# EAGLE schematic Microcontroller_Schematic_v41 (EAGLE 9.7.0)
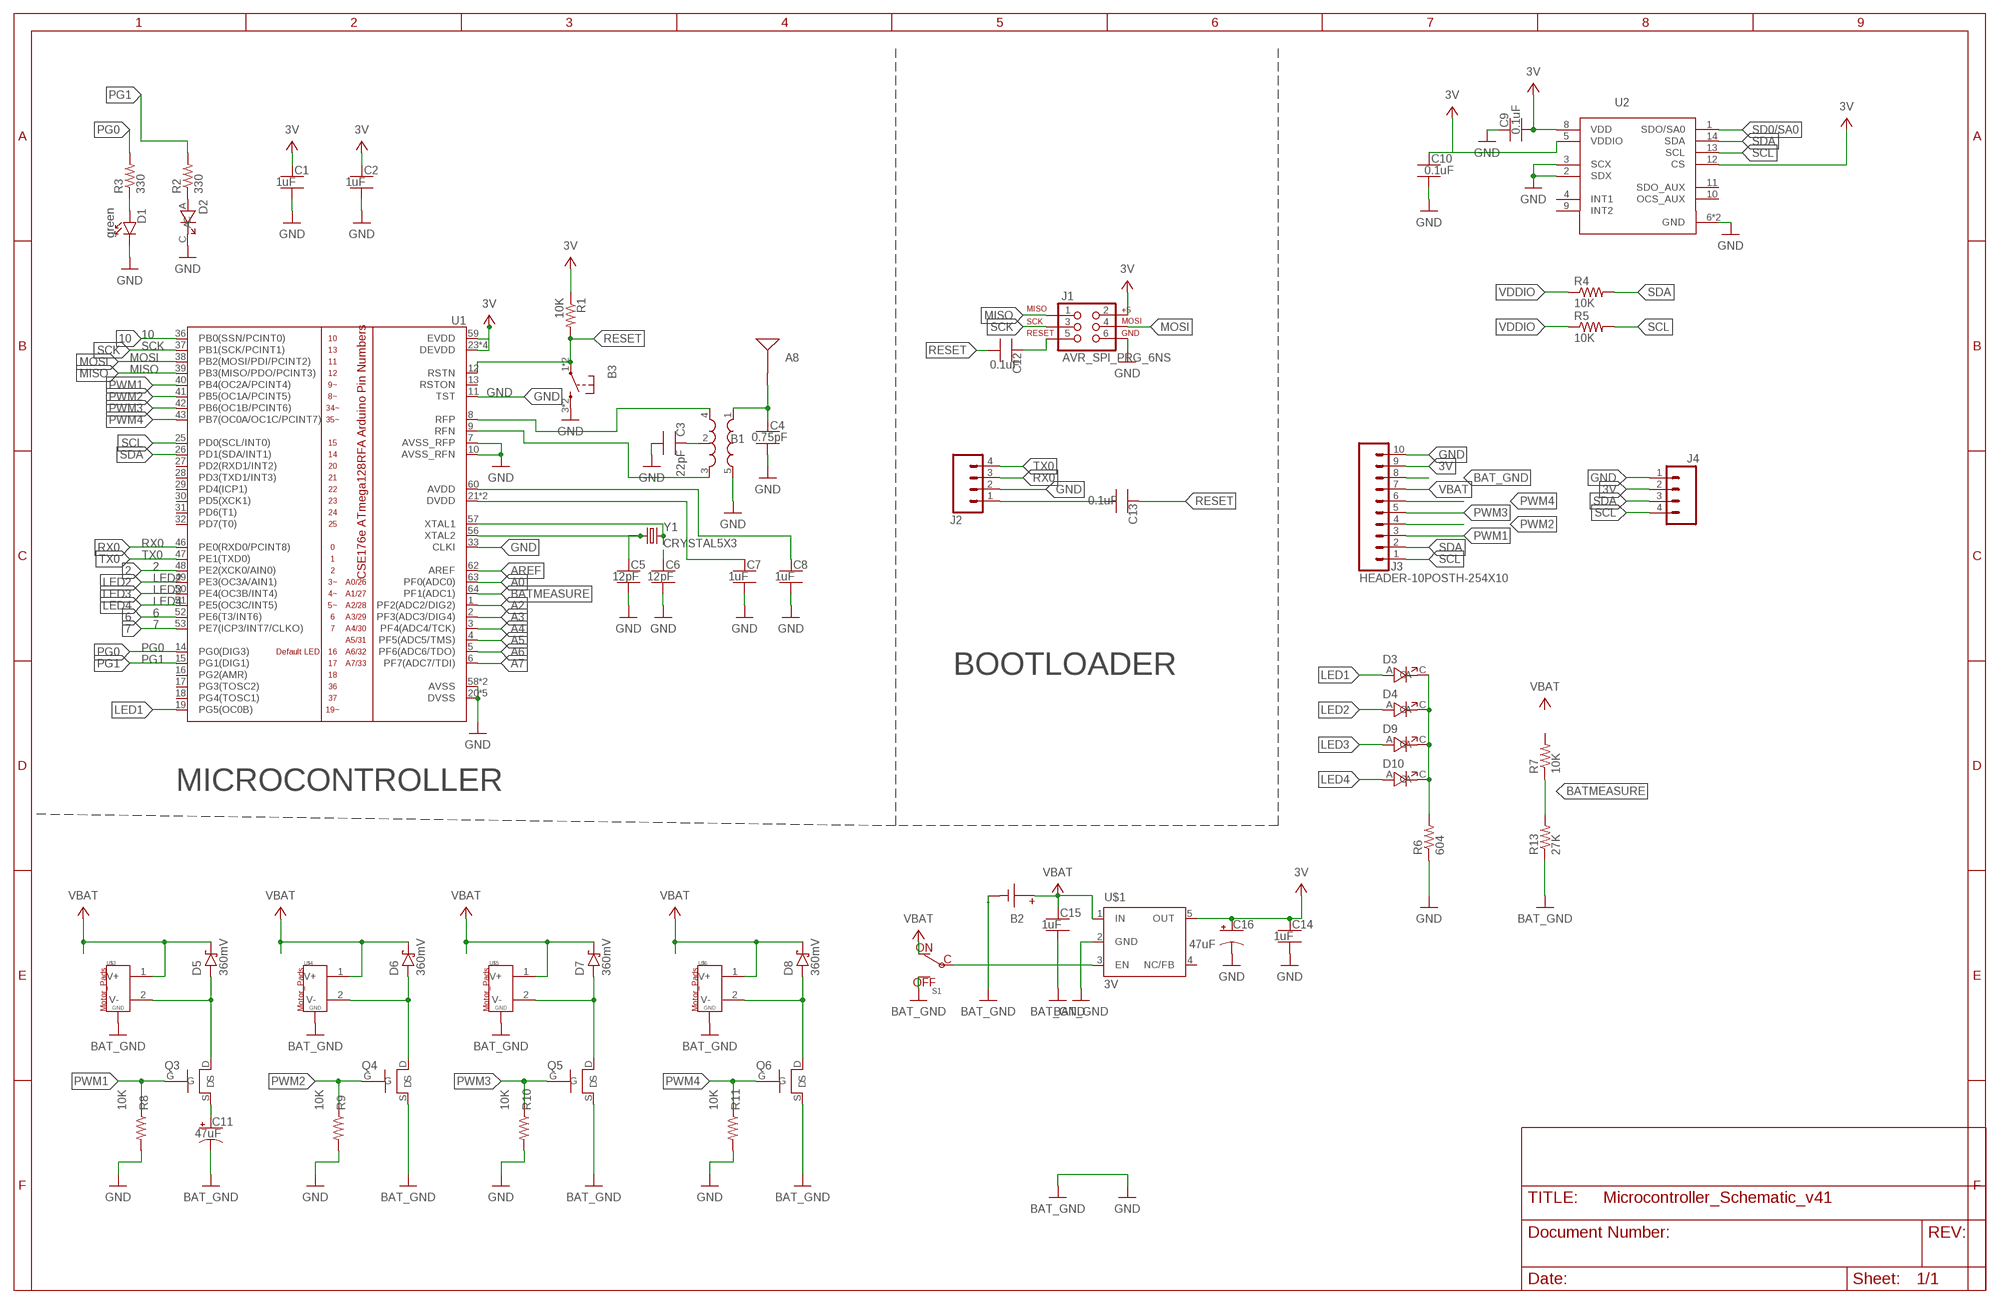
[diagram p0: schematic, sheet 1]
FRAME1 (FRAME_B_L): CREATOR: Unknown; DIST: Unknown; DISTPN: Unknown

## Parts
A8  ANTENNA-BOARD  [ANT_PCB_2.4GHZ_NRF8001_1.6MM_1OZ]
B1  BALUN0805  [BALUN]
B2  BATTERY-SCREW-TERMINAL-MINI-SMD  [2X1-SCREW-TERMINAL-TE-SMD-3.81MM]
B3  PUSHBUTTON_SMD-VERTICAL-1  [TE_FSM8JSMA_HS]
C1  1uF  CAPACITOR-NP_SMD-2012-0805_CERAMIC-1UF  [CAPC2012X140_HS]
C2  1uF  CAPACITOR-NP_SMD-2012-0805_CERAMIC-1UF  [CAPC2012X140_HS]
C3  22pF  CAPACITOR-NP_SMD-2012-0805_CERAMIC-22PF  [CAPC2012X140_HS]
C4  0.75pF  CAPACITOR-NP_SMD-2012-0805_CERAMIC-0.75PF  [CAPC2012X140_HS]
C5  12pF  CAPACITOR-NP_SMD-2012-0805_CERAMIC-12PF  [CAPC2012X140_HS]
C6  12pF  CAPACITOR-NP_SMD-2012-0805_CERAMIC-12PF  [CAPC2012X140_HS]
C7  1uF  CAPACITOR-NP_SMD-2012-0805_CERAMIC-1UF  [CAPC2012X140_HS]
C8  1uF  CAPACITOR-NP_SMD-2012-0805_CERAMIC-1UF  [CAPC2012X140_HS]
C9  0.1uF  CAPACITOR-NP_SMD-2012-0805_CERAMIC-0.1UF  [CAPC2012X140_HS]
C10  0.1uF  CAPACITOR-NP_SMD-2012-0805_CERAMIC-0.1UF  [CAPC2012X140_HS]
C11  47uF  CAPACITOR-POL_47UF-SMD-1206-TAJA  [CAPMP3216X180]
C12  0.1uF  CAPACITOR-NP_SMD-2012-0805_CERAMIC-0.1UF  [CAPC2012X140_HS]
C13  0.1uF  CAPACITOR-NP_SMD-2012-0805_CERAMIC-0.1UF  [CAPC2012X140_HS]
C14  1uF  CAPACITOR-NP_SMD-2012-0805_CERAMIC-1UF  [CAPC2012X140_HS]
C15  1uF  CAPACITOR-NP_SMD-2012-0805_CERAMIC-1UF  [CAPC2012X140_HS]
C16  47uF  CAPACITOR-POL_47UF-SMD-1206-TAJA  [CAPMP3216X180]
D1  green  DIODE-LED_SMD-2012-0805-GREEN  [LEDSC125X200X120-2_HS]
D2  LED-RED-160-1178-1-ND  [LED_160-1178-1-ND]
D3  LED-RED-160-1178-1-ND  [LED_160-1178-1-ND]
D4  LED-RED-160-1178-1-ND  [LED_160-1178-1-ND]
D5  360mV  DIODE-SCHOTTKY_-SMD-SOD123  [SODFL3516X96]
D6  360mV  DIODE-SCHOTTKY_-SMD-SOD123  [SODFL3516X96]
D7  360mV  DIODE-SCHOTTKY_-SMD-SOD123  [SODFL3516X96]
D8  360mV  DIODE-SCHOTTKY_-SMD-SOD123  [SODFL3516X96]
D9  LED-RED-160-1178-1-ND  [LED_160-1178-1-ND]
D10  LED-RED-160-1178-1-ND  [LED_160-1178-1-ND]
J1  AVR_SPI_PRG_6NS  [2X3-NS]
J2  HEADER-4POS-2X2-0.1IN-FEMALE-SMD-BOTTOM-ENTRY  [CONN4_969973-2]
J3  HEADER-10POSTH-254X10  [HDRV10W63P254_10X1_2540X254H838_HS]
J4  HEADER-4POS-2X2-0.1IN-FEMALE-SMD-BOTTOM-ENTRY  [CONN4_969973-2]
Q3  MOSFET-FET-SI2302CDS-T1-E3CT-NDSI2302CDS-T1-E3CT-ND  [MOSFET_FET_SI2302CDS-T1-E3CT-ND]
Q4  MOSFET-FET-SI2302CDS-T1-E3CT-NDSI2302CDS-T1-E3CT-ND  [MOSFET_FET_SI2302CDS-T1-E3CT-ND]
Q5  MOSFET-FET-SI2302CDS-T1-E3CT-NDSI2302CDS-T1-E3CT-ND  [MOSFET_FET_SI2302CDS-T1-E3CT-ND]
Q6  MOSFET-FET-SI2302CDS-T1-E3CT-NDSI2302CDS-T1-E3CT-ND  [MOSFET_FET_SI2302CDS-T1-E3CT-ND]
R1  10K  RESISTOR_SMD-2012-0805-10K  [RESC2012X60_HS]
R2  330  RESISTOR_SMD-2012-0805-330  [RESC2012X60_HS]
R3  330  RESISTOR_SMD-2012-0805-330  [RESC2012X60_HS]
R4  10K  RESISTOR_SMD-2012-0805-10K  [RESC2012X60_HS]
R5  10K  RESISTOR_SMD-2012-0805-10K  [RESC2012X60_HS]
R6  604  RESISTOR_SMD-2012-0805-604  [RESC2012X60_HS]
R7  10K  RESISTOR_SMD-2012-0805-10K  [RESC2012X60_HS]
R8  10K  RESISTOR_SMD-2012-0805-10K  [RESC2012X60_HS]
R9  10K  RESISTOR_SMD-2012-0805-10K  [RESC2012X60_HS]
R10  10K  RESISTOR_SMD-2012-0805-10K  [RESC2012X60_HS]
R11  10K  RESISTOR_SMD-2012-0805-10K  [RESC2012X60_HS]
R13  27K  RESISTOR_SMD-2012-0805-27K  [RESC2012X60_HS]
S1  POWER-SWITCH-MFS201N-9-Z-SMD-EDGE  [JS102011SAQN]
U1  ATMEGA128RFA1  [QFN-64]
U2  IMU-LSM6DSOXTR-497-18367-1-ND497-18367-1-ND  [LSM6DS0]
U$1  3V  TPS73633-DBVT3V  [SOT23-DBV]
U$3  MOTOR_PADS_GND-MOLEX-SMD  [MOLEX-0532610271]
U$4  MOTOR_PADS_GND-MOLEX-SMD  [MOLEX-0532610271]
U$5  MOTOR_PADS_GND-MOLEX-SMD  [MOLEX-0532610271]
U$6  MOTOR_PADS_GND-MOLEX-SMD  [MOLEX-0532610271]
Y1  CRYSTAL5X3  [CRYSTAL-SMD-5X3]

## Nets
2: U1.48(PE2(XCK0/AIN0))
3V: C1.1 C2.1 C14.1 C16.1(+) J1.2 J3.9 J4.2 R1.1 U1.23(DEVDD) U1.34(DEVDD) U1.44(DEVDD) U1.54(DEVDD) U1.59(EVDD) U2.12(CS) U$1.5(OUT)
6: U1.52(PE6(T3/INT6))
7: U1.53(PE7(ICP3/INT7/CLKO))
10: U1.36(PB0(SSN/PCINT0))
A0: U1.63(PF0(ADC0))
A2: U1.1(PF2(ADC2/DIG2))
A3: U1.2(PF3(ADC3/DIG4))
A4: U1.3(PF4(ADC4/TCK))
A5: U1.4(PF5(ADC5/TMS))
A6: U1.5(PF6(ADC6/TDO))
A7: U1.6(PF7(ADC7/TDI))
AREF: U1.62(AREF)
BAT_GND: B2.1(N) C11.2(-) C15.2 J3.8 Q4.S Q5.S Q6.S R13.1 S1.A(OFF) U$1.2(GND) U$3.G1(GND) U$3.G2(GND) U$4.G1(GND) U$4.G2(GND) U$5.G1(GND) U$5.G2(GND) U$6.G1(GND) U$6.G2(GND) ; supply symbol labelled GND
BATMEASURE: R7.1 R13.2 U1.64(PF1(ADC1))
GND: B1.5(GND) B3.3 B3.4 C1.2 C2.2 C3.2 C4.2 C5.2 C6.2 C7.2 C8.2 C9.1 C10.2 C14.2 C16.2(-) D1.C D2.C J1.6 J2.2 J3.10 J4.1 R6.1 R8.2 R9.2 R10.2 R11.2 U1.7(AVSS_RFP) U1.10(AVSS_RFN) U1.11(TST) U1.20(DVSS) U1.24(DVSS) U1.33(CLKI) U1.35(DVSS) U1.45(DVSS) U1.55(DVSS) U1.58(AVSS) U1.61(AVSS) U2.2(SDX) U2.3(SCX) U2.6(GND) U2.7(GND)
LED1: D3.A U1.19(PG5(OC0B))
LED2: D4.A U1.49(PE3(OC3A/AIN1))
LED3: D9.A U1.50(PE4(OC3B/INT4))
LED4: D10.A U1.51(PE5(OC3C/INT5))
MISO: J1.1 U1.39(PB3(MISO/PDO/PCINT3))
MOSI: J1.4 U1.38(PB2(MOSI/PDI/PCINT2))
N$1: D1.A R3.1
N$2: D2.A R2.1
N$4: B1.4(OUT1) U1.8(RFP)
N$5: B1.2(GND) C3.1
N$6: B1.3(OUT2) U1.9(RFN)
N$7: A8.FEED(SIGNAL) B1.1(IN) C4.1
N$8: C8.1 U1.60(AVDD)
N$9: C7.1 U1.21(DVDD) U1.22(DVDD)
N$10: C6.1 U1.57(XTAL1) Y1.3
N$11: C5.1 U1.56(XTAL2) Y1.1
N$12: C9.2 U2.8(VDD) ; supply symbol labelled 3V
N$13: C10.1 U2.5(VDDIO)
N$14: C12.2
N$15: C13.2 J2.1
N$16: C11.1(+) Q3.S
N$18: D5.2(A) Q3.D U$3.2(V-)
N$19: D6.2(A) Q4.D U$4.2(V-)
N$20: D7.2(A) Q5.D U$5.2(V-)
N$21: D8.2(A) Q6.D U$6.2(V-)
N$22: D3.C D4.C D9.C D10.C R6.2
N$23: S1.C U$1.3(EN)
PG0: R3.2 U1.14(PG0(DIG3))
PG1: R2.2 U1.15(PG1(DIG1))
PWM1: J3.3 Q3.G R8.1 U1.40(PB4(OC2A/PCINT4))
PWM2: J3.4 Q4.G R9.1 U1.41(PB5(OC1A/PCINT5))
PWM3: J3.5 Q5.G R10.1 U1.42(PB6(OC1B/PCINT6))
PWM4: J3.6 Q6.G R11.1 U1.43(PB7(OC0A/OC1C/PCINT7))
RESET: B3.1 B3.2 C12.1 C13.1 J1.5 R1.2 U1.12(RSTN)
RX0: J2.3 U1.46(PE0(RXD0/PCINT8))
SCK: J1.3 U1.37(PB1(SCK/PCINT1))
SCL: J3.1 J4.4 R5.2 U1.25(PD0(SCL/INT0)) U2.13(SCL)
SD0/SA0: U2.1(SDO/SA0)
SDA: J3.2 J4.3 R4.2 U1.26(PD1(SDA/INT1)) U2.14(SDA)
TX0: J2.4 U1.47(PE1(TXD0))
VBAT: B2.2(P) C15.1 D5.1(C) D6.1(C) D7.1(C) D8.1(C) J3.7 S1.B(ON) U$1.1(IN) U$3.1(V+) U$4.1(V+) U$5.1(V+) U$6.1(V+)
VDDIO: R4.1 R5.1
Unconnected: R7.2 U1.13(RSTON) U1.16(PG2(AMR)) U1.17(PG3(TOSC2)) U1.18(PG4(TOSC1)) U1.27(PD2(RXD1/INT2)) U1.28(PD3(TXD1/INT3)) U1.29(PD4(ICP1)) U1.30(PD5(XCK1)) U1.31(PD6(T1)) U1.32(PD7(T0)) U2.4(INT1) U2.9(INT2) U2.10(OCS_AUX) U2.11(SDO_AUX) U$1.4(NC/FB)

## Notes on the sheet
- BOOTLOADER
- MICROCONTROLLER

## Library data of the parts
A8 = quadparts_prebuilt_2022:ANTENNA: Single endded antenna.; CREATOR: Swanson; DESC: trace antenna; DIST: NA; DISTPN: NA; MFR: NA; MOUNTING: NONE; MPN: NA; POPULATE: NO
B1 = quadparts_prebuilt_2022:BALUN: A balun to convert differential radio-frequency outputs from the microcontroller into a single-ended driver for the antenna.; CREATOR: Swanson; DATASHEET: http://katalog.we-online.de/pbs/datasheet/748421245.pdf; DESC: BALUN 2.4GHZ-2.5GHZ 50/100 0805; DIST: Digikey; DISTPN: 732-2230-1-ND; MFR: Wurth Electronics Inc.; MOUNTING: SMD; MPN: 748421245; PACKAGE: 0805; PRICE: 2.63; REVIEWER: Swanson
B2 = quadparts_prebuilt_2022:BATTERY: Connections for a battery.
B3 = quadparts_prebuilt_2022:PUSHBUTTON_: "Tactile" or "clicky" button.; CREATOR: Swanson; DIST: Digikey; DISTPN: 450-1129-ND; MFR: TE Connectivity Alcoswitch Switches; MOUNTING: SMD; MPN: FSM4JSMA; REVIEWER: Swanson
C1 C2 C7 C8 C14 C15 = quadparts_prebuilt_2022:CAPACITOR-NP_: Nonpolarized capacitor; CREATOR: Swanson; DIST: Digikey; DISTPN: 587-1281-1-ND; MFR: Taiyo Yuden; MOUNTING: SMD; MPN: TMK212B7105KG-T; REVIEWER: Swanson
C3 = quadparts_prebuilt_2022:CAPACITOR-NP_: Nonpolarized capacitor; CREATOR: Swanson; DESC: CAP CER 22PF 250V C0G/NP0 0805; DIST: Digikey; DISTPN: 490-5534-1-ND; MFR: Murata Electronics; MOUNTING: SMD; MPN: GRM21A5C2E220JW01D; PACKAGE: 0805; REVIEWER: Swanson
C4 = quadparts_prebuilt_2022:CAPACITOR-NP_: Nonpolarized capacitor; CREATOR: Swanson; DESC: CAP CER 0.75PF 100V C0G/NP0 0805; DIST: Digikey; DISTPN: 490-3585-1-ND; MFR: Murata Electronics; MOUNTING: SMD; MPN: GQM2195C2AR75CB01D; PACKAGE: 0805; REVIEWER: Swanson
C5 C6 = quadparts_prebuilt_2022:CAPACITOR-NP_: Nonpolarized capacitor; CREATOR: Swanson; DESC: CAP CER 12PF 250V C0G/NP0 0805; DIST: Digikey; DISTPN: 490-5531-1-ND; MFR: Murata Electronics; MOUNTING: SMD; MPN: GRM21A5C2E120JW01D; PACKAGE: 0805; REVIEWER: Swanson
C9 C10 C12 C13 = quadparts_prebuilt_2022:CAPACITOR-NP_: Nonpolarized capacitor; CREATOR: Swanson; DESC: CAP CER 0.1UF 100V X7R 0805; DIST: Digikey; DISTPN: 445-1418-1-ND; MFR: TDK Corporation; MOUNTING: SMD; MPN: C2012X7R2A104K125AA; PACKAGE: 0805; REVIEWER: Swanson
C11 C16 = quadparts_prebuilt_2022:CAPACITOR-POL_: Polarized capacitor; CREATOR: Swanson; DESC: CAP TANT 47UF 10% 6.3V 1206; DIST: DIGIKEY; DISTPN: 478-11462-1-ND; MFR: AVX Corporation; MOUNTING: SMD; MPN: TAJA476K006SNJV; PACKAGE: 1206
D1 = quadparts_prebuilt_2022:DIODE-LED_: Light emitting diode; CREATOR: Swanson; DIST: Digikey; DISTPN: 160-1179-1-ND; MFR: Lite-On Inc; MOUNTING: SMD; MPN: LTST-C170GKT; REVIEWER: Swanson
D2-D4 D9 D10 = custom_v9:LED; CREATOR: KaustubhKanagalekar; DIST: Digikey; DISTPN: 160-1178-1-ND
D5-D8 = quadparts_prebuilt_2022:DIODE-SCHOTTKY_: Schottky diode; CREATOR: Swanson; DESC: DIODE SCHOTTKY 30V 1.5A SFLAT; DIST: Digikey; DISTPN: CRS08QMCT-ND; MFR: Toshiba Semiconductor and Storage; MOUNTING: SMD; MPN: CRS08(TE85L,Q,M); REVIEWER: Swanson
J1 = quadparts_prebuilt_2022:AVR_SPI_PRG_6: AVR ISP 6 Pin This is the in-system programming (ISP) connector for Atmel Microcontrollers programming.; CREATOR: Swanson; DATASHEET: http://portal.fciconnect.com/Comergent//fci/drawing/67996.pdf; DIST: Digikey; DISTPN: 609-3234-ND; MFR: Amphenol FCI; MOUNTING: TH; MPN: 67997-206HLF; PRICE: 0.31; REVIEWER: Swanson
J2 J4 = quadparts_prebuilt_2022:HEADER-4POS; CREATOR: DIGIKEY; DIST: DIGIKEY; DISTPN: A107056CT-ND; MANUFACTURER_PART_NUMBER: 9699732; MOUNTING: SMD; VENDOR: TE Connectivity
J3 = quadparts_prebuilt_2022:HEADER-10POS: 10 pin single inline pin header, socket, or connector; CREATOR: Swanson; DATASHEET: http://portal.fciconnect.com/Comergent//fci/drawing/68000.pdf; DIST: Digikey; DISTPN: 609-3250-ND; MFR: Amphenol FCI; MOUNTING: TH; MPN: 68000-110HLF; PRICE: 0.55; REVIEWER: Swanson
Q3-Q6 = custom_v9:MOSFET-FET-SI2302CDS-T1-E3CT-ND; CREATOR: KaustubhKanagalekar; DIST: Digikey; DISTPN: SI2302CDS-T1-E3CT-ND
R1 R4 R5 R7-R11 = quadparts_prebuilt_2022:RESISTOR_: Resistor; CREATOR: Swanson; DESC: RES SMD 10K OHM 5% 1/8W 0805; DIST: Digikey; DISTPN: 311-10KARCT-ND; MFR: Yageo; MOUNTING: SMD; MPN: RC0805JR-0710KL; PACKAGE: 0805; REVIEWER: Swanson
R2 R3 = quadparts_prebuilt_2022:RESISTOR_: Resistor; CREATOR: Swanson; DIST: Digikey; DISTPN: 311-330ARCT-ND; MFR: Yageo; MOUNTING: SMD; MPN: RC0805JR-07330RL; REVIEWER: Swanson
R6 = quadparts_prebuilt_2022:RESISTOR_: Resistor; CREATOR: Swanson; DIST: DIGIKEY; DISTPN: 311-604CRCT-ND; MOUNTING: SMD
R13 = quadparts_prebuilt_2022:RESISTOR_: Resistor; CREATOR: Swanson; DIST: DIGIKEY; DISTPN: 311-27.0KCRCT-ND; MOUNTING: SMD
S1 = quadparts_prebuilt_2022:POWER-SWITCH-MFS201N-9-Z; CREATOR: Swanson; DESC: SWITCH SLIDE SPDT 300MA 6V; DIST: DIGIKEY; DISTPN: 401-1999-1-ND; MFR: C&K; MOUNTING: SMD; MPN: JS102011SAQN
U1 = quadparts_prebuilt_2022:ATMEGA128RFA1: ATmega128RFA1 8-bit AVR Microcontroller with Low Power 2.4GHz Transceiver for ZigBee and IEEE 802.15.4; CREATOR: Swanson; DATASHEET: http://www.atmel.com/Images/Atmel-8266-MCU_Wireless-ATmega128RFA1_Datasheet.pdf; DESC: IC RF TXRX+MCU 802.15.4 64VFQFN; DIST: Digikey; DISTPN: ATMEGA128RFA1-ZU-ND; MFR: Microchip Technology; MOUNTING: SMD; MPN: ATMEGA128RFA1-ZU; PACKAGE: QFN; PRICE: 10.21; REVIEWER: Swanson
U2 = custom_v9:IMU-LSM6DSOXTR-497-18367-1-ND; CREATOR: KaustubhKanagalekar; DIST: Digikey; DISTPN: 497-18367-1-ND
U$1 = quadparts_prebuilt_2022:TPS73633-DBVT: LP3985-series voltage regulators.; CREATOR: Swanson; DATASHEET: http://www.ti.com/lit/ds/symlink/lp3985.pdf; DIST: Digikey; DISTPN: LP3985IM5X-3.0/NOPBCT-ND; MFR: Texas Instruments; MOUNTING: SMD; MPN: LP3985IM5X-3.0/NOPB; PRICE: 0.59; REVIEWER: Swanson
U$3-U$6 = quadparts_prebuilt_2022:MOTOR_PADS_GND: Connections a brushed motor.; CREATOR: Swanson; DESC: CONN HEADER SMD R/A 2POS 1.25MM; DIST: DIGIKEY; DISTPN: WM7620CT-ND; MFR: Molex; MOUNTING: SMD; MPN: 532610271
Y1 = quadparts_prebuilt_2022:CRYSTAL: Crystals to provide clock references for microcontrollers, etc.; CREATOR: Swanson; DATASHEET: http://www.abracon.com/Resonators/abm3b.pdf; DESC: CRYSTAL 16.0000MHZ 18PF SMD; DIST: Digikey; DISTPN: 535-9122-1-ND; MFR: Abracon LLC; MOUNTING: SMD; MPN: ABM3B-16.000MHZ-B2-T; PRICE: 0.68; PROD_ID: XTAL-08218; REVIEWER: Swanson